# EAGLE design timer (EAGLE 7.7.0)
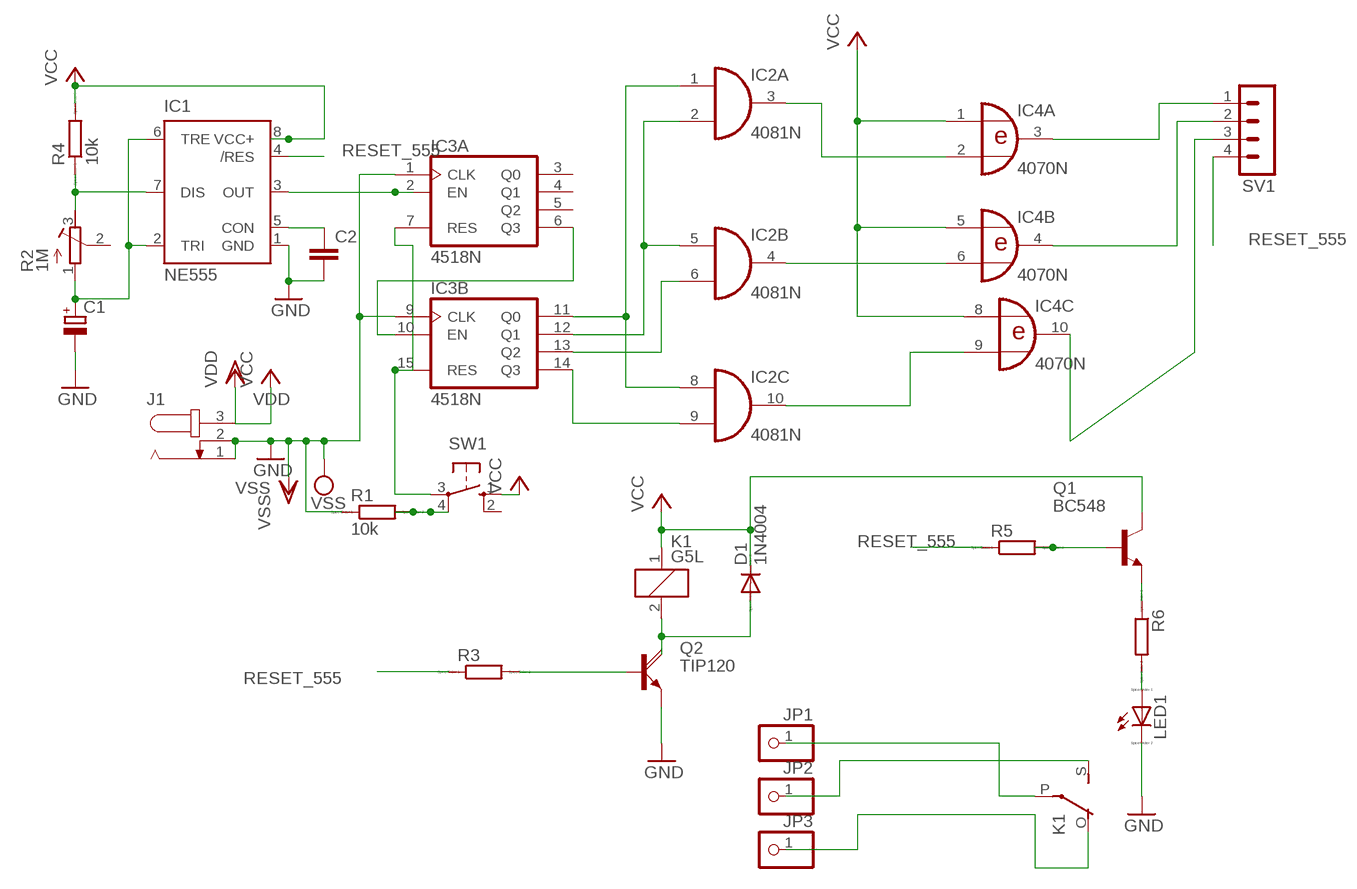
[diagram p0: schematic, sheet 1]

## Parts
C1  CPOL-EUE2.5-6  [E2,5-6]
C2  C-EU025-024X044  [C025-024X044]
D1  1N4004  [DO41-10]
IC1  NE555  [DIL-08]
IC2  4081N  [DIL14]
IC3  4518N  [DIL16]
IC4  4070N  [DIL14]
J1  JACK-PLUG0  [SPC4077]
JP1  PINHD-1X1  [1X01]
JP2  PINHD-1X1  [1X01]
JP3  PINHD-1X1  [1X01]
K1  G5L  [G5LE]
LED1  LED_ELD260  [LED_LD260]
Q1  BC548  [TO92-EBC]
Q2  TIP120  [TO220AH]
R1  10k  R0207/10  [0207/10]
R2  1M  R-TRIMM64W  [RTRIM64W]
R3  R0207/10  [0207/10]
R4  10k  R0207/10  [0207/10]
R5  R0207/10  [0207/10]
R6  R0207/10  [0207/10]
SV1  MA04-1  [MA04-1]
SW1  10-XX  [B3F-10XX]

## Nets
N$1: C1.+ IC1.2(TRI) IC1.6(TRE) R2.1(A)
N$2: IC1.3(OUT) IC3.2(A:EN)
N$3: Q2.B R3.2
N$4: IC1.7(DIS) R2.3(E) R4.1
N$5: R1.2 SW1.4(P1)
N$6: IC3.7(A:RES) IC3.15(B:RES) SW1.3(P)
N$7: C2.1 IC1.5(CON)
N$8: IC2.1(A:I0) IC2.8(C:I0) IC3.11(B:Q0)
N$9: IC2.2(A:I1) IC2.5(B:I0) IC3.12(B:Q1)
N$10: IC2.6(B:I1) IC3.13(B:Q2)
N$11: IC2.9(C:I1) IC3.14(B:Q3)
N$12: IC4.3(A:O) SV1.1
N$13: IC2.10(C:O) IC4.9(C:I1)
N$14: IC4.10(C:O) SV1.3
N$15: IC4.4(B:O) SV1.2
N$16: D1.A K1.2 Q2.C
N$17: IC2.3(A:O) IC4.2(A:I1)
N$18: IC2.4(B:O) IC4.6(B:I1)
N$19: JP1.1 K1.P(2:P)
N$20: JP2.1 K1.S(2:S)
N$21: JP3.1 K1.O(2:O)
N$22: Q1.B R5.2
N$23: LED1.A R6.2
N$24: Q1.E R6.1
Q3_EN2: IC3.6(A:Q3) IC3.10(B:EN)
RESET_555: IC1.4(/RES) R3.1 R5.1 SV1.4
VDD: D1.C IC1.8(VCC+) IC4.1(A:I0) IC4.5(B:I0) IC4.8(C:I0) J1.3 K1.1 Q1.C R4.2 SW1.1(S) ; supply symbol labelled VCC
VSS: C1.- C2.2 IC1.1(GND) IC3.1(A:CLK) IC3.9(B:CLK) J1.1 J1.2 LED1.K(C) Q2.E R1.1 ; supply symbol labelled GND
Unconnected: IC2.11(D:O) IC2.12(D:I0) IC2.13(D:I1) IC3.3(A:Q0) IC3.4(A:Q1) IC3.5(A:Q2) IC4.11(D:O) IC4.12(D:I0) IC4.13(D:I1) R2.2(S) SW1.2(S1)

## Power pins joined to a net without a drawn wire
VDD: IC2.14(P:VDD) IC3.16(P:VDD) IC4.14(P:VDD)
VSS: IC2.7(P:VSS) IC3.8(P:VSS) IC4.7(P:VSS)

## Library data of the parts
C1 = rcl:CPOL-EU: POLARIZED CAPACITOR, European symbol
C2 = resistor:C-EU: CAPACITOR, European symbol
D1 = diode:1N4004: DIODE general purpose rectifier, 1 A
IC1 = st-microelectronics:NE555: General purpose bipolar Timer; MF: Arrow Electronics; MPN: NE555N; OC_FARNELL: 1467742; OC_NEWARK: 89K1486
IC2 = 40xx:4081: Quad 2-input AND
IC3 = 45xx:4518: Dual BCD up COUNTER
IC4 = 40xx:4070: Quad 2-input XOR
J1 = con-jack:JACK-PLUG: DC POWER JACK Power Jack, DC, Right Angle, Through Hole, Rated 5A at 16VDC, PC Terminals Distributor: Farnell (www.Farnell.de) Drawing: 84N1161.pdf / 84N1162.pdf Manufacturer: SPC Technology (www.spctechnology.com) Type: SPC4077 / SPC 4078; OC_FARNELL: unknown; OC_NEWARK: unknown
JP1-JP3 = pinhead:PINHD-1X1: PIN HEADER
K1 = relay:G5L: RELAY 1 x switch, 10 A/120 V AC, 8 A/30 V ADC, Omron; OC_FARNELL: unknown; OC_NEWARK: unknown
LED1 = eagle-ltspice:LED_E: LED Source: http://www.osram.convergy.de Source: www.luxeon.com Source: www.kingbright.com; SPICEMODEL: NONE; SPICEPREFIX: D; SPICETYPE: diode
Q1 = transistor-npn:BC548*: NPN Transistor
Q2 = transistor-power:TIP120: NPN DARLINGTON TRANSISTOR
R1 R3-R6 = eagle-ltspice:R: RESISTOR, European symbol; SPICEMODEL: NONE; SPICEPREFIX: R
R2 = rcl:R-TRIMM: Trimm resistor
SV1 = con-lstb:MA04-1: PIN HEADER; OC_FARNELL: unknown; OC_NEWARK: unknown
SW1 = buttons:10-XX: OMRON SWITCH

## Net classes
0 default: clearance 0.205 mm

## Board
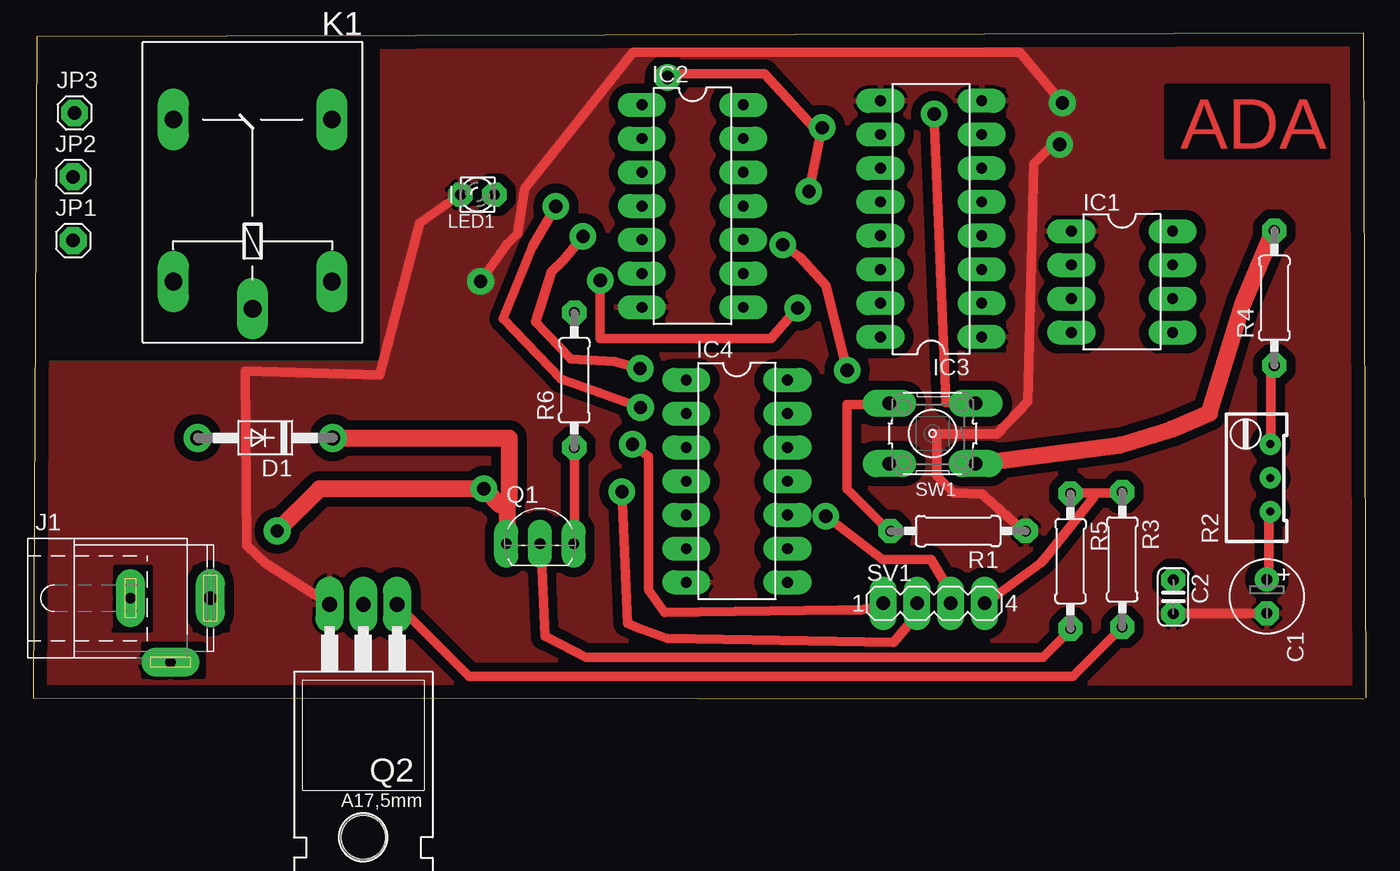
[diagram p1: board, top side]
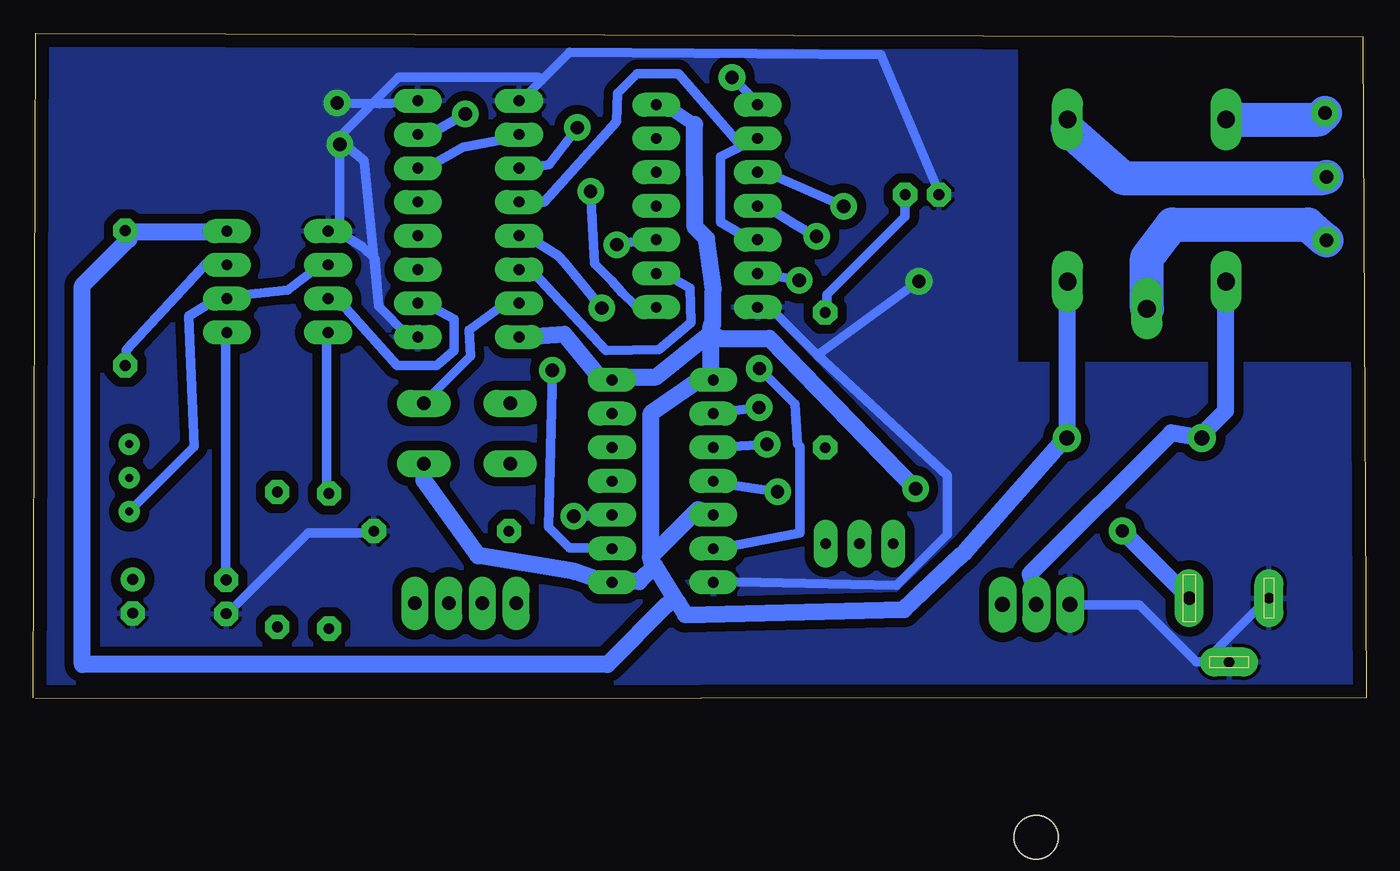
[diagram p2: board, bottom side, seen from below]

Size 100.3 x 50.1 mm. Coordinates in mm from the lower left corner, seen from the top.
Outline: 100.3,0.1 100.1,50.1 0.25,49.85 0,0.1 100.1,0
Copper layers (1*16): Top 0.035mm / dielectric 1.5mm / Bottom 0.035mm
Design rules "timer *": minimum track width 0.7mm, minimum drill 1mm, track to track 0.7mm, track to pad 0.7mm, pad to pad 0.7mm, via to via 0.7mm, smd to smd 8mil, copper to edge 40mil, drill to drill 8mil, minimum pad ring 0.5mm, minimum via ring 0.5mm, stop-mask expansion 4mil, vias tented up to drill 0mil, thermal gap 10mil
tRestrict: area 9.4,41.4 to 11.9,45.6; area 21,41.1 to 24,45.5; area 21.2,28.8 to 23.8,33.6; area 15,27.1 to 18.2,31.7; area 9.2,29.1 to 12.1,33.7; area 6.1,5.2 to 8.8,9.9; area 12.2,5.2 to 14.6,9.9; area 8.3,1.7 to 12.8,4.1; area 85.3,40.8 to 97.4,46.1; area 76.8,26.8 to 79.1,36.2; area 84.7,26.8 to 87.2,36.2; area 44.8,28.3 to 47.3,45.8; 5 more areas

### Footprints (pad centres in the part's own frame; a part is rotated, then mirrored left to right if it is on the bottom)
E2,5-6 = drill 0.813 pad 1.6: + -1.27,0 | drill 0.813 pad 1.6 octagon: - 1.27,0
C025-024X044 = drill 0.813 octagon: 1 -1.27,0; 2 1.27,0
DO41-10 = drill 1.118: A 5.08,0; C -5.08,0
DIL-08 = drill 0.813 long: 1 -3.81,-3.81; 2 -1.27,-3.81; 3 1.27,-3.81; 4 3.81,-3.81; 5 3.81,3.81; 6 1.27,3.81; 7 -1.27,3.81; 8 -3.81,3.81
DIL14 = drill 0.813 long: 1 -7.62,-3.81; 2 -5.08,-3.81; 3 -2.54,-3.81; 4 0,-3.81; 5 2.54,-3.81; 6 5.08,-3.81; 7 7.62,-3.81; 8 7.62,3.81; 9 5.08,3.81; 10 2.54,3.81; 11 0,3.81; 12 -2.54,3.81; 13 -5.08,3.81; 14 -7.62,3.81
DIL16 = drill 0.813 long: 1 -8.89,-3.81; 2 -6.35,-3.81; 3 -3.81,-3.81; 4 -1.27,-3.81; 5 1.27,-3.81; 6 3.81,-3.81; 7 6.35,-3.81; 8 8.89,-3.81; 9 8.89,3.81; 10 6.35,3.81; 11 3.81,3.81; 12 1.27,3.81; 13 -1.27,3.81; 14 -3.81,3.81; 15 -6.35,3.81; 16 -8.89,3.81
SPC4077 = drill 0.8 pad 2.184 long: 1 -3,0; 2 0,-4.8 | drill 1 pad 2.184 long: 3 3,0
1X01 = drill 1.016 octagon: 1 0,0
G5LE = drill 1.321 long: 1 -7.493,-5.969; 2 -7.493,5.969; O 4.699,5.969; P -9.525,0; S 4.699,-5.969
LED_LD260 = drill 0.813 octagon: A -1.27,0; K 1.27,0
TO92-EBC = drill 0.813 long: B 0,-1.27; C -2.54,-1.27; E 2.54,-1.27
TO220AH = drill 1.118 long: B -2.54,-6.35; C 0,-6.35; E 2.54,-6.35 | hole 3.302: 0,11.176
0207/10 = drill 0.813 octagon: 1 -5.08,0; 2 5.08,0
RTRIM64W = drill 0.61: 1 1.27,-2.54; 2 1.27,0; 3 1.27,2.54
MA04-1 = drill 1.016 long: 1 -3.81,0; 2 -1.27,0; 3 1.27,0; 4 3.81,0
B3F-10XX = drill 1.016 long: 1 -3.251,2.261; 2 3.251,2.261; 3 -3.251,-2.261; 4 3.251,-2.261

### Placement (x,y rotation side)
C1  92.82,7.72 270 top
C2  85.77,7.68 270 top
D1  17.46,19.65 180 top
IC1  81.92,31.39 270 top
IC2  49.61,37.1 270 top
IC3  67.55,36.13 90 top
IC4  52.94,16.39 270 top
J1  10.32,7.58 0 top
JP1  3,34.5 0 top
JP2  3,39.3 0 top
JP3  3.1,44.1 0 top
K1  16.51,38.9 90 top
LED1  33.43,37.95 180 top
Q1  38.13,12.96 0 top
Q2  24.84,0.76 180 top
R1  69.59,12.63 180 top
R2  91.81,16.64 0 top
R3  81.93,10.5 270 top
R4  93.39,30.17 90 top
R5  78.05,10.37 270 top
R6  40.71,23.99 90 top
SV1  67.77,7.19 0 top
SW1  67.67,19.97 180 top

### Tracks (layer width: path | path; a pad name or v marks a point on that pad's centre or on a via)
N$1
  Top 0.7: R2.1 92.97,14.07 92.97,9.15 C1.+
  Bottom 0.7: IC1.2 78.2,32.64 78.68,32.64 81.16,30.76 85.67,30.26 IC1.6 85.98,30.42 88.61,28.8 88.21,18.99 92.97,14.23 R2.1
N$2
  Bottom 0.7: IC3.2 71.22,29.63 70.58,29.63 68.64,28.58 68.64,26.21 69.95,25.1 72.91,25.1 77.41,30.1 78.05,30.1 IC1.3
N$3
  Top 0.7: R3.2 81.86,5.34 78.2,1.69 32.8,1.69 27.41,7.08 Q2.B
N$4
  Top 0.7: R2.3 93.13,19.31 93.13,25.02 93.29,25.02 R4.1
  Bottom 0.7: IC1.7 85.82,32.64 87.3,32.74 93.29,26.26 93.29,25.18 R4.1
N$5
  Top 0.7: R1.2 64.39,12.64 61.22,15.82 61.22,22.17 64.39,22.17 SW1.4
N$6  (via drill 1)
  Top 0.7: v67.78,44.03 68.68,22.33 70.9,22.33 SW1.3
  Bottom 0.7: IC3.15 63.76,29.63 64.85,29.73 67.51,27.77 67.41,25.82 70.9,22.33 SW1.3 | v67.78,44.03 70.43,42.49 71.22,42.49 IC3.7
N$7
  Bottom 0.7: C2.1 85.82,8.99 85.82,27.56 IC1.5
N$8  (via drill 1)
  Top 0.7: v58.36,38.2 v59.36,43 59.18,42.5 55.03,47.05 48.14,47.05 v47.73,46.77
  Bottom 0.7: v58.36,38.2 58.06,32.75 56.79,31.48 55.98,30.58 55.03,29.63 53.44,29.63 IC2.8 | v59.36,43 61.47,40.2 63.12,39.95 63.6,39.95 IC3.11 | v47.73,46.77 45.82,44.87 IC2.1
N$9
  Bottom 0.7: 47.01,41.61 46.45,42.17 45.82,42.17 IC2.2 | 47.01,41.61 48.6,40.82 48.6,35.9 46.61,34.71 45.82,34.71 IC2.5 | 47.01,41.61 51.75,47.05 54.87,47.05 56.32,45.6 56.42,43.44 61.85,37.41 63.6,37.41 IC3.12
N$10  (via drill 1)
  Top 0.7: v42.66,31.51 42.66,27.12 55.52,27.12 v57.52,29.42
  Bottom 0.7: v42.66,31.51 45.66,32.01 IC2.6 | v57.52,29.42 57.29,29.12 60.32,32.84 60.82,33.36 62.97,34.71 63.6,34.71 IC3.13
N$11
  Bottom 0.7: IC2.9 53.28,32.01 52.8,32.01 50.9,30.9 50.8,28.33 53.22,26.31 57.21,26.21 62.66,32.07 63.6,32.17 IC3.14
N$12  (via drill 1)
  Top 0.7: v45.09,19.16 46.3,18.26 46.3,8.22 47.49,6.53 60.7,6.7 62.33,6.7 63.92,7.08 SV1.1
  Bottom 0.7: v45.09,19.16 50.42,18.83 49.15,18.83 IC4.3
N$13  (via drill 1)
  Top 0.7: v61.24,24.74 59.64,31.09 57.7,33.23 v56.4,34.19
  Bottom 0.7: v61.24,24.74 61.54,12.96 59.95,11.37 56.77,11.37 IC4.9 | v56.4,34.19 54.23,34.55 53.44,34.55 IC2.10
N$14  (via drill 1)
  Top 0.7: v59.63,13.75 63.9,10.48 67.55,10.48 69,8.04 69,7.24 SV1.3
  Bottom 0.7: v59.63,13.75 56.77,13.75 IC4.10
N$15  (via drill 1)
  Top 0.7: v44.3,15.59 44.7,5.7 45.5,5.34 47.7,4.54 64.71,4.24 66.46,6.29 66.46,7.08 SV1.2
  Bottom 0.7: v44.3,15.59 49,16.29 IC4.4
N$16
  Bottom 0.7: 24.71,7.24 Q2.C | 12.48,19.63 D1.A 12.32,19.94 | 10.58,31.37 K1.2
  Bottom 1.27: 24.71,7.24 25.31,9.39 14.67,20.03 12.48,19.63 | 10.58,31.37 10.58,21.69 12.32,19.94
N$17  (via drill 1)
  Top 0.7: v45.7,21.93 42.56,23.07 39.72,24.07 35.37,28.62 37.57,34.07 v39.33,37.07
  Bottom 0.7: v45.7,21.93 49,21.53 IC4.2 | v39.33,37.07 45.19,39.63 45.66,39.63 IC2.3
N$18  (via drill 1)
  Top 0.7: v45.66,24.87 43.73,25.39 40.46,25.59 37.79,28.36 38.99,32.17 39.82,32.97 v41.36,34.81
  Bottom 0.7: v45.66,24.87 42.99,22.2 42.8,19.2 42.59,18.99 42.59,12.5 48.52,11.37 49,11.37 IC4.6 | v41.36,34.81 41.94,35.08 43.04,35.74 45.19,37.09 45.66,37.09 IC2.4
N$19
  Bottom 2.54: K1.P 16.51,33.19 14.6,35.7 4.4,35.7 JP1.1
N$20
  Bottom 0.406: K1.S 22.48,42.88
  Bottom 2.54: 22.48,42.88 18.3,39.2 3.2,39.2 JP2.1
N$21
  Bottom 0.7: 10.42,43.6 K1.O
  Bottom 2.54: 10.42,43.6 3.6,43.6 JP3.1
N$22
  Top 0.7: Q1.B 38.2,11.53 38.5,4.7 38.7,4.62 41.6,3.12 75.98,3.12 78.05,5.18 R5.2
N$23
  Bottom 0.7: R6.2 40.58,29.15 40.58,30.42 34.71,36.3 34.71,37.88 LED1.A
N$24
  Top 0.7: Q1.E 40.74,11.69 40.74,18.83 R6.1
N$25
  Bottom 0.406: 49.1,23.9 49.3,23.9
  Bottom 1.27: 49.3,23.9 49.3,28.1
Q3_EN2
  Bottom 0.7: IC3.10 63.76,42.33 67.96,41.53 70.74,39.95 71.22,39.95 IC3.6
RESET_555
  Top 0.7: 79.79,15.5 81.86,15.5 R3.1 | 79.79,15.5 78.2,15.5 R5.1 | SV1.4 71.7,7.24 75.81,10.25 76.27,10.75 79.79,15.18 79.79,15.5
  Bottom 0.7: IC1.4 78.2,27.56 78.2,15.5 R5.1
VDD  (via drill 1)
  Top 0.7: 35.82,15.18 35.66,15.02 | 35.66,11.69 Q1.C | 22.64,19.63 D1.C | 34.1,15.6 v33.91,15.82 | 35.1,14.6 35.66,14.6 | 71.06,17.72 SW1.1
  Top 1.27: v18.36,12.64 21.53,15.82 v33.91,15.82 | 35.66,15.02 35.66,14.6 35.66,11.69 | 35.82,15.18 35.82,19.63 22.64,19.63 | 35.1,14.6 34.1,15.6 | 93.29,35.18 91.01,29.7 88.5,21.5 85.7,20.32 81.81,19.12 71.06,17.72
  Bottom 0.7: 56.77,24.07 IC4.14 56.46,24.23 | 63.6,27.25 IC3.16 | 52.8,44.71 53.28,44.71 IC2.14 | 49.17,30.58 49.13,30.84 | 49.41,27.46 49.17,28.2 | 13.44,7.72 J1.3 | 22.48,31.37 K1.1 | 22.48,19.79 D1.C 22.6,19.6 22.8,19.47 | 53.52,10.02 53.86,10.68 53.8,10.42 | 56.62,8.83 IC4.8 57.1,9.1 57.1,8.83 | 49.15,13.75 IC4.5 | 49.79,24.31 49.15,23.91 | 85.82,35.18 IC1.8 | 93.29,35.18 R4.2 93.1,34.6 | 52.6,7.1 52.1,7.1 51.82,7.28 | 70.9,17.56 SW1.1
  Bottom 1.016: 50.53,43.23 52.8,44.71
  Bottom 1.27: 56.77,24.07 57.57,24.07 60.34,27.45 63.6,27.25 | 49.13,30.84 49.63,34.63 50.5,35.5 50.53,43.23 | 49.17,28.2 49.17,30.58 | 56.46,24.23 53.44,24.23 49.41,27.46 48.57,27.12 44.92,27.12 v33.91,15.82 | v18.36,12.64 13.44,7.72 | 22.48,19.79 22.48,31.37 | 56.62,8.83 54.71,8.83 53.52,10.02 51.82,7.28 51.22,6.33 34.78,6.73 30.54,10.77 30.14,11.13 22.8,19.47 | 53.86,10.68 50.29,14.25 49.15,13.75 | 49.79,24.31 53.8,21.5 53.8,10.42 | 49.15,23.91 IC4.1 | 93.29,35.18 85.82,35.18 | 93.1,34.6 96.6,31.1 96.6,2.6 57.1,2.6 52.6,7.1 | 70.9,17.56 70.9,16.45 66.83,10.78 59.56,9.58 57.41,8.83 57.1,8.83 57.09,8.83
VSS  (via drill 1)
  Top 0.7: v77.44,44.84 74.24,48.68 45.11,48.68 36.95,38.42 36.45,35.02 35.66,34.23 v33.66,31.43 | 22.17,7.24 18.07,9.84 17.46,10.24 16.05,11.55 15.95,24.69 26.07,24.39 29.06,35.81 32.01,37.88 LED1.K | C1.- 85.82,6.45 C2.2 | 74.55,12.64 71.38,15.42 69.27,15.52 68,16.79 68,19.92 72.49,19.92 74.84,22.37 75.3,40.3 76.73,41.73 v77.24,41.73
  Bottom 0.7: 41.3,25.9 44.87,29.47 45.66,29.47 IC2.7 | 41.3,25.9 31.51,16.81 31.51,12.37 35.34,8.53 49,8.83 IC4.7 | v77.44,44.84 74.24,44.8 72.17,44.87 71.38,44.87 IC3.8 | 41.3,25.9 v33.66,31.43 | J1.1 7.4,7.56 11.85,3.12 J1.2 | 10.42,2.8 12.8,2.8 17.09,7.08 22.17,7.08 Q2.E | 74.71,12.48 79.63,12.48 85.67,6.45 C2.2 | 71.6,27.25 72.01,27.25 74.32,29.55 | 71.6,27.25 71.38,27.25 | 74.32,29.55 74.56,33.1 75.56,34.04 77.41,35.18 78.05,35.18 IC1.1 77.25,35.5 77.25,42.33 72.81,46.77 62.33,46.77 62.09,46.53 | 32.07,37.94 36.5,48.48 59.95,48.68 62.09,46.53 | 63.6,45.03 62.09,46.53 | v77.24,41.73 76.64,41.54 75.4,40.5 74.32,29.55 | IC3.1 71.6,27.1 71.6,27.25
  pour Bottom: -0.11,25.15 26.4,25.15 26.4,51 100.94,51.15 100.94,-1.42 -0.41,-1.42
  pour Top: 0.05,25.22 26.3,25.22 26.3,50.9 102.97,52.42 102.97,-3.71 -0.15,-3.71

### Text on the board
Top: ADA